# EAGLE design spsu (EAGLE 6.1)
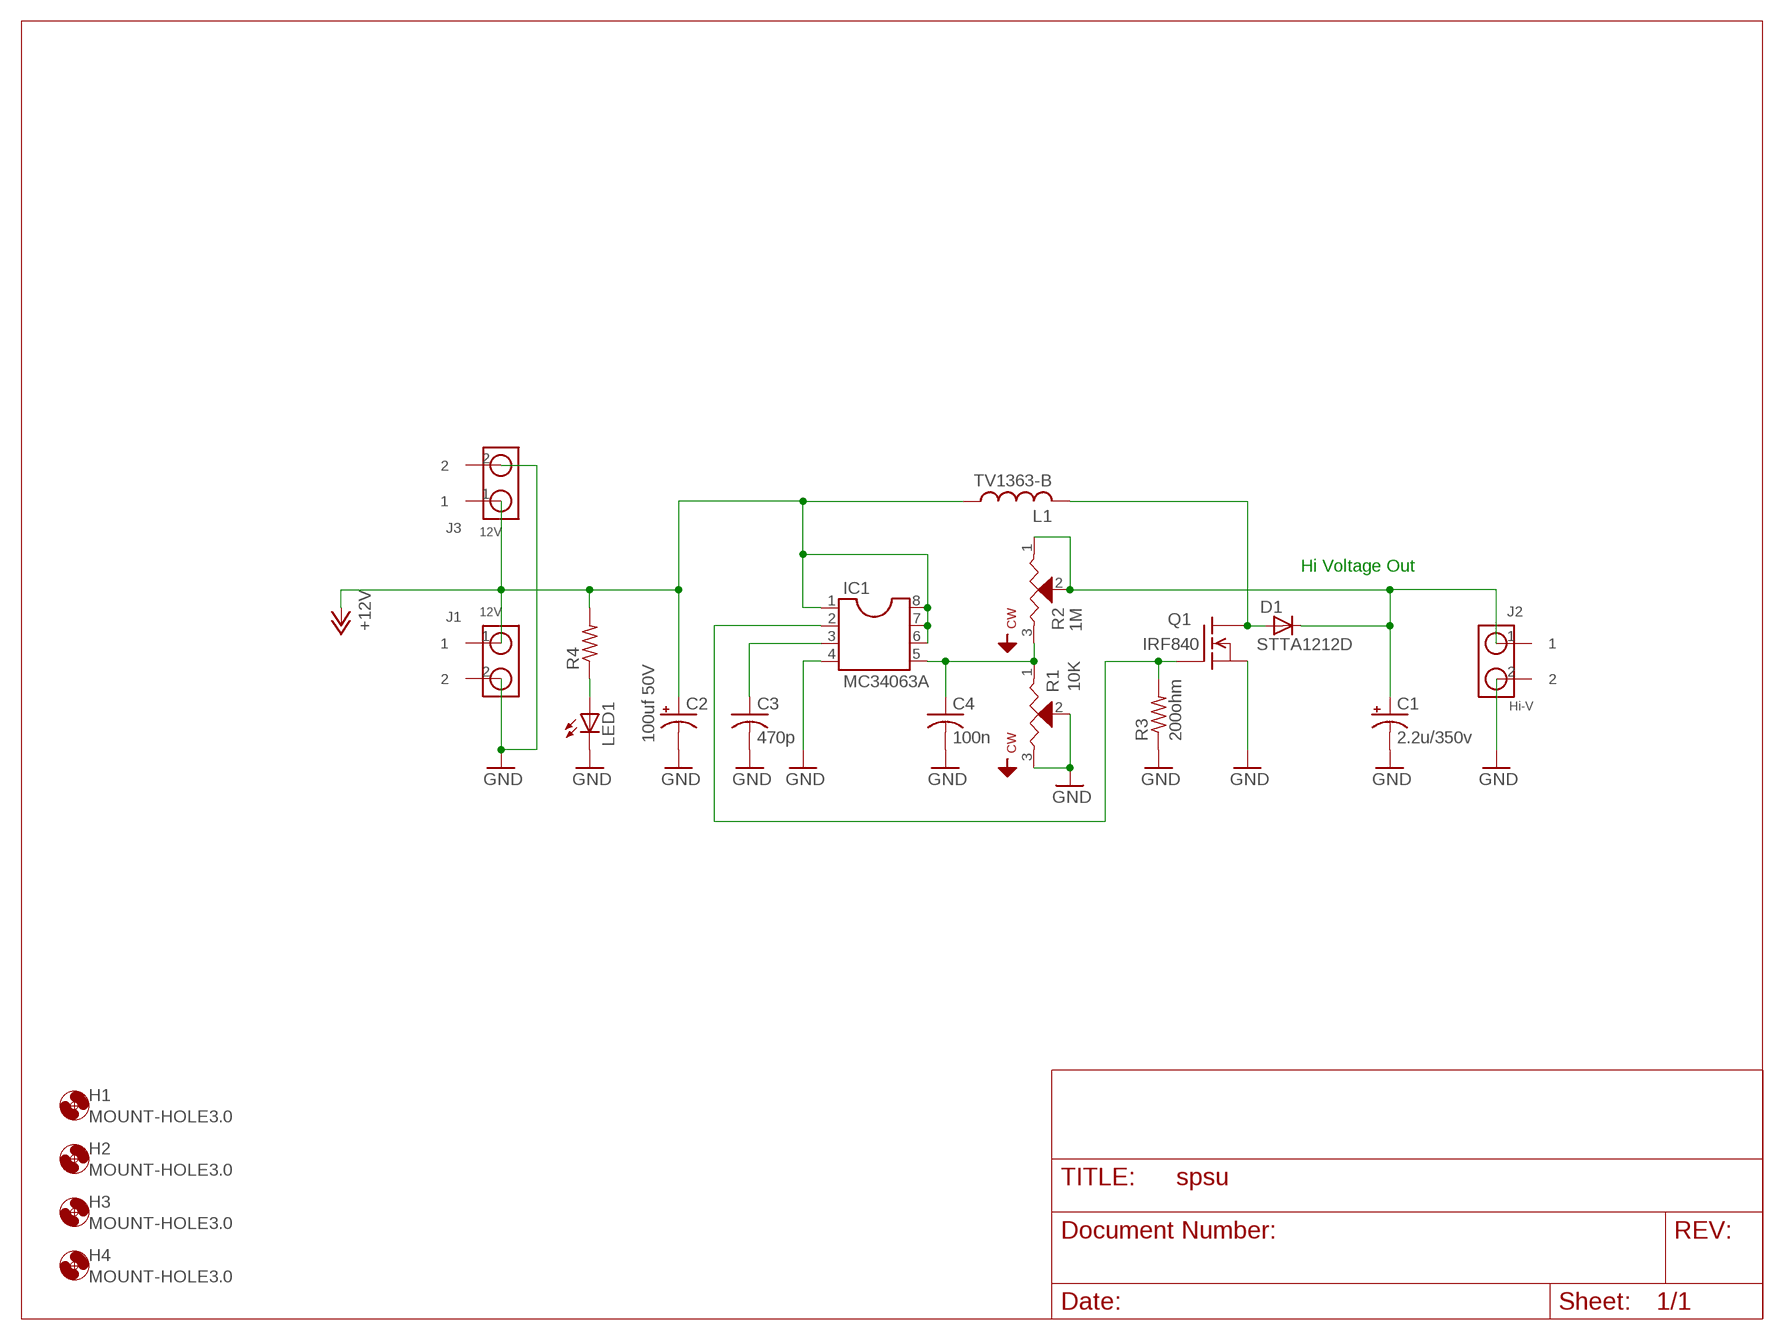
[diagram p0: schematic, sheet 1]

## Parts
C1  2.2u/350v  CPOL-USE5-8.5  [E5-8,5]
C2  100uf 50V  CPOL-USE5-8.5  [E5-8,5]
C3  470p  C-US025-040X050  [C025-040X050]
C4  100n  C-US025-040X050  [C025-040X050]
D1  STTA1212D  [TO220ACS]
H1  MOUNT-HOLE3.0  [3,0]
H2  MOUNT-HOLE3.0  [3,0]
H3  MOUNT-HOLE3.0  [3,0]
H4  MOUNT-HOLE3.0  [3,0]
IC1  MC34063A  [DIL08]
J1  12V  MOLEX-2PIN-BASE  [MOLEX-001-2PIN]
J2  Hi-V  MOLEX-2PIN-BASE  [MOLEX-001-2PIN]
J3  12V  MOLEX-2PIN-BASE  [MOLEX-001-2PIN]
L1  TV1363-B  TV1363-B-COIL  [RADIAL-VMOUNT-8-5MM]
LED1  LED3MM  [LED3MM]
Q1  IRF840  IRF840-FET  [TO220V]
R1  10K  .25SQ-TOPADJ-TRIMPOT  [.25IN-TOP-TRIMPOT]
R2  1M  .25SQ-TOPADJ-TRIMPOT  [.25IN-TOP-TRIMPOT]
R3  200ohm  R-US_0204/5  [0204/5]
R4  R-US_0204/5  [0204/5]

## Nets
+12V: C2.+ IC1.1 IC1.6 IC1.7 IC1.8 J1.1 J3.1 L1.1 R4.2
GND: C1.- C2.- C3.2 C4.2 IC1.4 J1.2 J2.2 J3.2 LED1.K(C) Q1.3(S) R1.2 R1.3 R3.1
HIVOLTAGEOUT: C1.+ D1.C J2.1 R2.1 R2.2
N$1: LED1.A R4.1
N$3: D1.A L1.2 Q1.2(D)
N$4: C4.1 IC1.5 R1.1 R2.3
N$5: C3.1 IC1.3
N$6: IC1.2 Q1.1(G) R3.2

## Notes on the sheet
- Hi Voltage Out

## Library data of the parts
C1 C2 = rcl:CPOL-US: POLARIZED CAPACITOR, American symbol
C3 C4 = rcl:C-US: CAPACITOR, American symbol
D1 = kmarx1:STTA1212D: DIODE high-efficiency fast recovery rectifier (ST) TO-220AC 12 Amp1200 Volt Mouser Part #: 511-STTA1212D 1@$1.70, 100 @ $1.45
H1-H4 = holes:MOUNT-HOLE: MOUNTING HOLE with drill center marker
IC1 = kmarx1:MC34063A: 1.5A step-up/down inverting switch regulator IC,MC34063AP1,8-DIP, SWTH V-REG STPUP/DN/INV 40VDC Jameco #: 316945 MFG:MAJOR BRANDS MFG#:MC34063AP1
J1-J3 = kmarx1:MOLEX-2PIN-BASE: Molex 2-pin header 22-03-2021,KK SERIES,FL,ST,TIN
L1 = kmarx1:TV1363-B-COIL: Coilcraft # TV1363-B. 220 uH 5% @ 100 KHz 0.1 V 0 ADC. 0.4 ohm DC resistance 0.32? dia. x 0.59? high radial choke. Leads on 5 mm centers. Tape and reel packaging Allelectronics: CAT # CR-220 4 for $ 1.00 100 for 20¢ each ? 600 for 15¢ each 1200 for 10¢ each
LED1 = led:LED: LED OSRAM: - CHIPLED LG R971, LG N971, LY N971, LG Q971, LY Q971, LO R971, LY R971 LH N974, LH R974 LS Q976, LO Q976, LY Q976 LO Q996 - Hyper CHIPLED LW Q18S LB Q993, LB Q99A, LB R99A - SideLED LS A670, LO A670, LY A670, LG A670, LP A670 LB A673, LV A673, LT A673, LW A673 LH A674 LY A675 LS A676, LA A676, LO A676, LY A676, LW A676 LS A679, LY A679, LG A679 - Hyper Micro SIDELED® LS Y876, LA Y876, LO Y876, LY Y876 LT Y87S - SmartLED LW L88C, LW L88S LB L89C, LB L89S, LG L890 LS L89K, LO L89K, LY L89K LS L896, LA L896, LO L896, LY L896 - TOPLED LS T670, LO T670, LY T670, LG T670, LP T670 LSG T670, LSP T670, LSY T670, LOP T670, LYG T670 LG T671, LOG T671, LSG T671 LB T673, LV T673, LT T673, LW T673 LH T674 LS T676, LA T676, LO T676, LY T676, LB T676, LH T676, LSB T676, LW T676 LB T67C, LV T67C, LT T67C, LS T67K, LO T67K, LY T67K, LW E67C LS E67B, LA E67B, LO E67B, LY E67B, LB E67C, LV E67C, LT E67C LW T67C LS T679, LY T679, LG T679 LS T770, LO T770, LY T770, LG T770, LP T770 LB T773, LV T773, LT T773, LW T773 LH T774 LS E675, LA E675, LY E675, LS T675 LS T776, LA T776, LO T776, LY T776, LB T776 LHGB T686 LT T68C, LB T68C - Hyper Mini TOPLED® LB M676 - Mini TOPLED Santana® LG M470 LS M47K, LO M47K, LY M47K Source: http://www.osram.convergy.de LUXEON: - LUMILED® LXK2-PW12-R00, LXK2-PW12-S00, LXK2-PW14-U00, LXK2-PW14-V00 LXK2-PM12-R00, LXK2-PM12-S00, LXK2-PM14-U00 LXK2-PE12-Q00, LXK2-PE12-R00, LXK2-PE12-S00, LXK2-PE14-T00, LXK2-PE14-U00 LXK2-PB12-K00, LXK2-PB12-L00, LXK2-PB12-M00, LXK2-PB14-N00, LXK2-PB14-P00, LXK2-PB14-Q00 LXK2-PR12-L00, LXK2-PR12-M00, LXK2-PR14-Q00, LXK2-PR14-R00 LXK2-PD12-Q00, LXK2-PD12-R00, LXK2-PD12-S00 LXK2-PH12-R00, LXK2-PH12-S00 LXK2-PL12-P00, LXK2-PL12-Q00, LXK2-PL12-R00 Source: www.luxeon.com KINGBRIGHT: KA-3528ASYC Source: www.kingbright.com
Q1 = kmarx1:IRF840-FET: N-Channel Enhancement MOSFE (HEXFET); 500V; 8A; 0,85Ohm Jameco #: 184719 1,10,100 @ $1.49,$1.29,$99 electronics goldmine; g15414 $.99/ea
R1 R2 = kmarx1:.25SQ-TOPADJ-TRIMPOT: Bourns 3262P Series Trim Pot 3262P1/4" Square Trimmer 1/2 watt cermet top adj
R3 R4 = rcl:R-US_: RESISTOR, American symbol

## Board
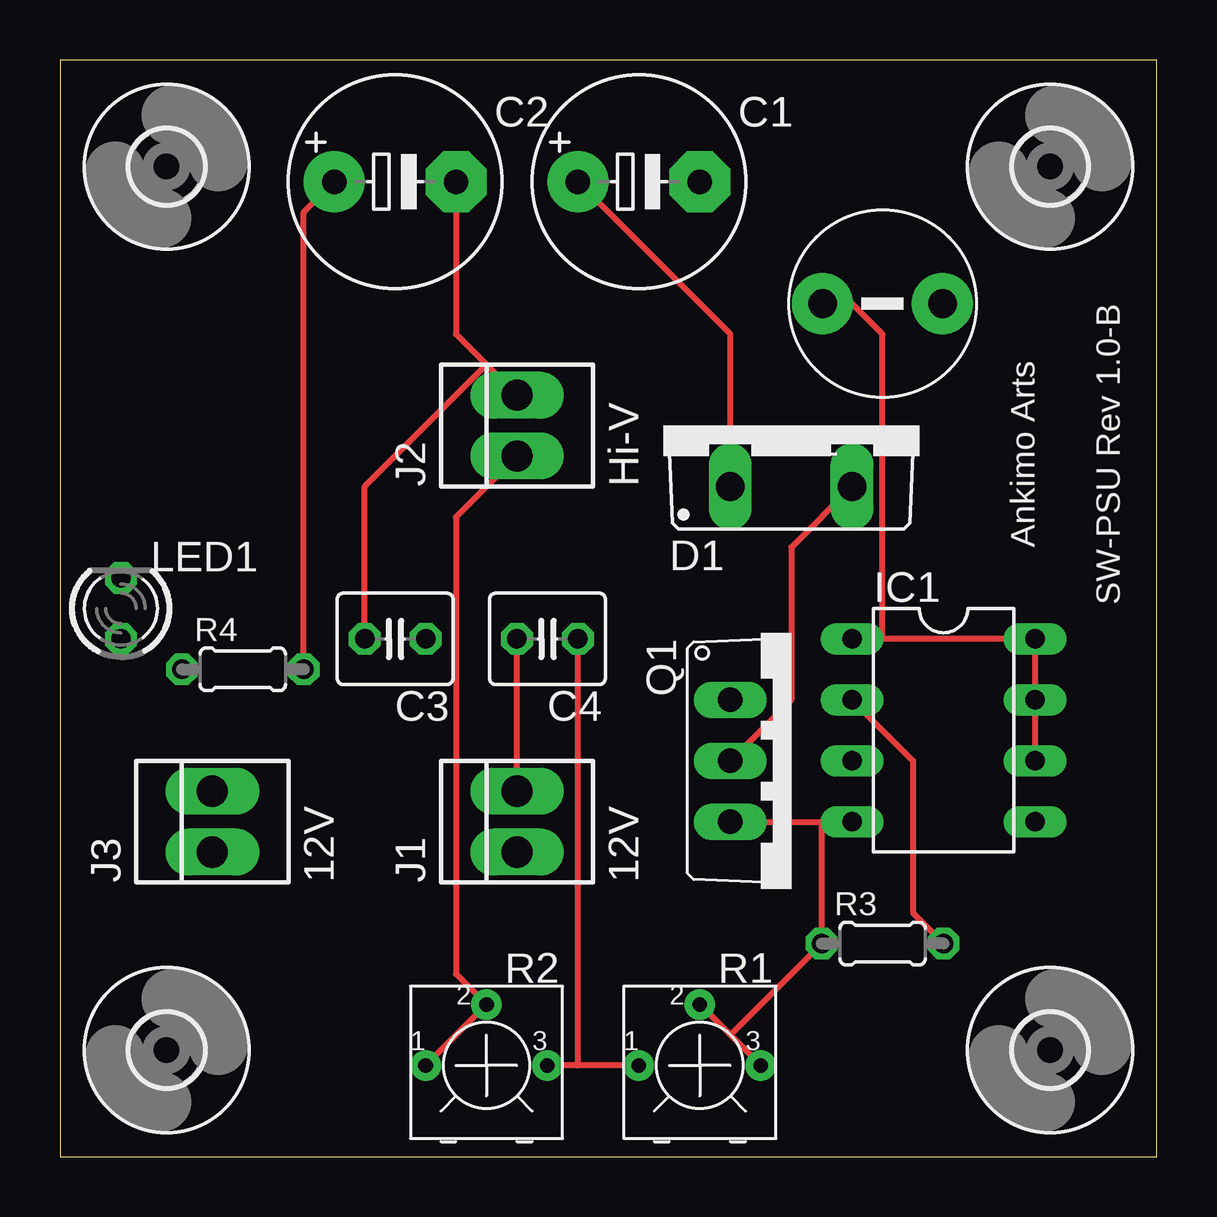
[diagram p1: board, top side]
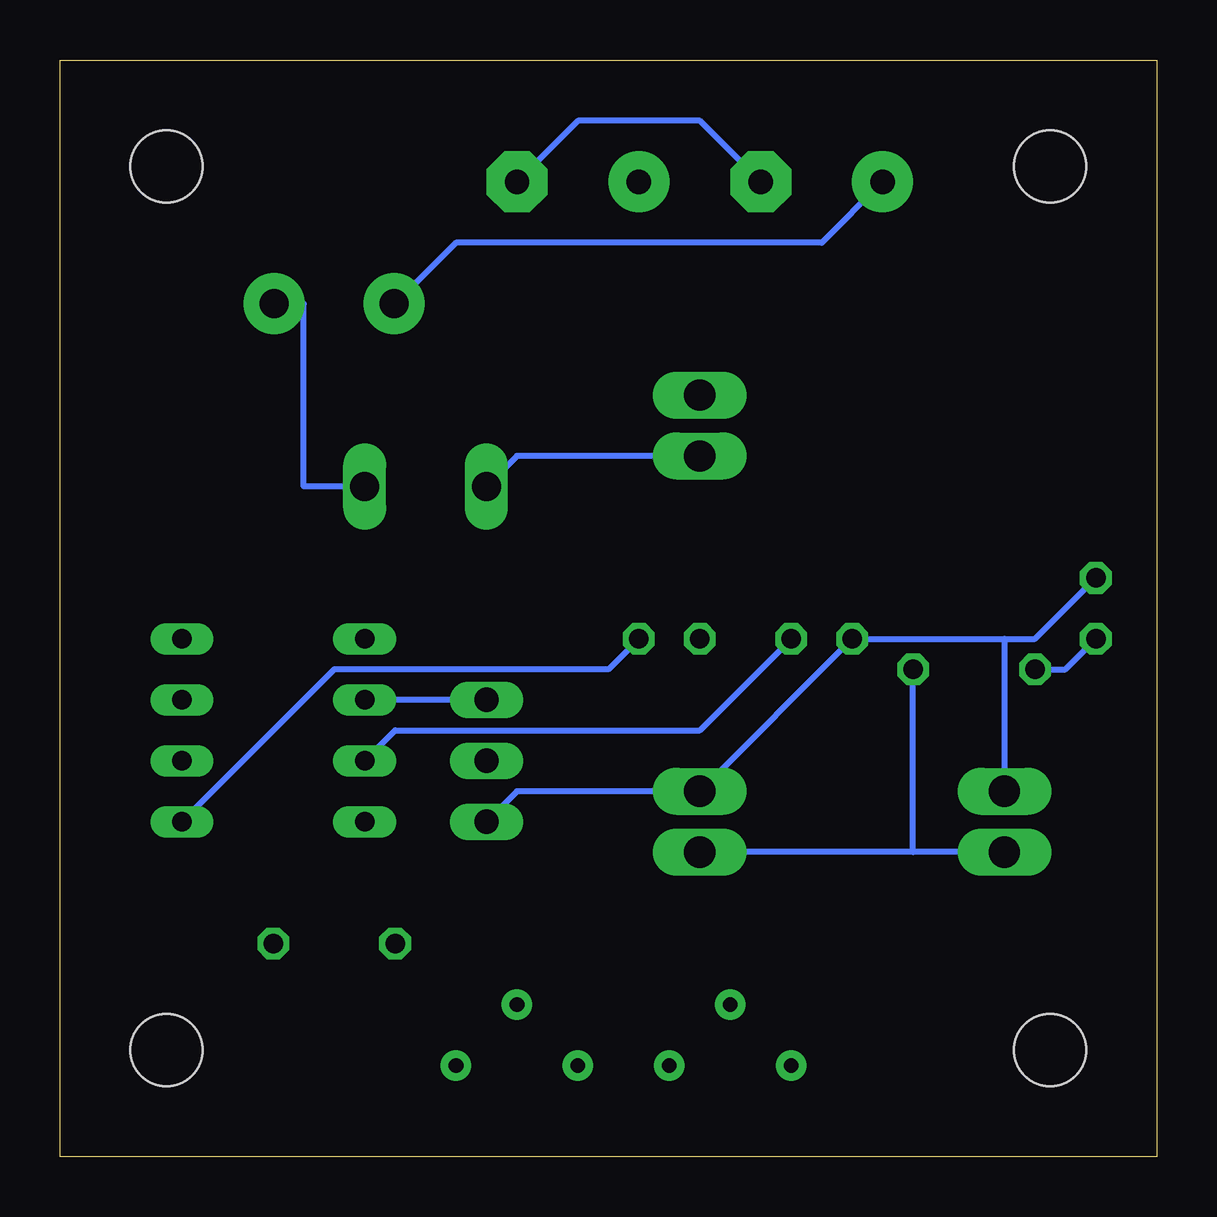
[diagram p2: board, bottom side, seen from below]

Size 45.72 x 45.72 mm. Coordinates in mm from the lower left corner, seen from the top.
Outline: 0,0 45.72,0 45.72,45.72 0,45.72 0,0
Copper layers (1*16): Top 0.035mm / dielectric 1.5mm / Bottom 0.035mm
Design rules: minimum track width 10mil, minimum drill 24mil, track to track 8mil, track to pad 8mil, pad to pad 8mil, via to via 8mil, smd to smd 8mil, copper to edge 40mil, drill to drill 8mil, minimum pad ring 10mil, minimum via ring 8mil, stop-mask expansion 4mil, vias tented up to drill 0mil, thermal gap 10mil

### Footprints (pad centres in the part's own frame; a part is rotated, then mirrored left to right if it is on the bottom)
E5-8,5 = drill 1.016 pad 2.54: + -2.54,0 | drill 1.016 pad 2.54 octagon: - 2.54,0
C025-040X050 = drill 0.813 octagon: 1 -1.27,0; 2 1.27,0
TO220ACS = drill 1.2 long: A 2.54,0 | drill 1.2 pad 1.778 long: C -2.54,0
3,0 = hole 3: 0,0
DIL08 = drill 0.813 long: 1 -3.81,-3.81; 2 -1.27,-3.81; 3 1.27,-3.81; 4 3.81,-3.81; 5 3.81,3.81; 6 1.27,3.81; 7 -1.27,3.81; 8 -3.81,3.81
MOLEX-001-2PIN = drill 1.3 long: 1 -1.27,0; 2 1.27,0
RADIAL-VMOUNT-8-5MM = drill 1.2 pad 2.54: 1 -2.5,0; 2 2.5,0
LED3MM = drill 0.813 octagon: A -1.27,0; K 1.27,0
TO220V = drill 1.016 long: 1 -2.54,0; 2 0,0; 3 2.54,0
.25IN-TOP-TRIMPOT = drill 0.61 pad 1.27: 1 -2.54,0; 2 0,2.54; 3 2.54,0
0204/5 = drill 0.813 octagon: 1 -2.54,0; 2 2.54,0

### Placement (x,y rotation side)
C1  24.13,40.64 0 top
C2  13.97,40.64 0 top
C3  13.97,21.59 180 top
C4  20.32,21.59 180 top
D1  30.48,27.94 0 top
H1  4.45,41.27 0 top
H2  4.45,4.45 0 top
H3  41.27,41.27 0 top
H4  41.27,4.45 0 top
IC1  36.83,17.78 270 top
J1  19.05,13.97 90 top
J2  19.05,30.48 90 top
J3  6.35,13.97 90 top
L1  34.29,35.56 0 top
LED1  2.54,22.86 90 top
Q1  27.94,16.51 270 top
R1  26.67,3.81 0 top
R2  17.78,3.81 0 top
R3  34.29,8.89 0 top
R4  7.62,20.32 0 top

### Tracks (layer width: path | path; a pad name or v marks a point on that pad's centre or on a via)
+12V
  Top 0.254: IC1.6 IC1.7 IC1.8 34.29,21.59 | 34.29,21.59 34.29,34.29 33.02,35.56 L1.1 | 34.29,21.59 IC1.1 | C2.+ 10.16,39.37 R4.2
  Bottom 0.254: 10.16,12.7 R4.2 | J3.1 10.16,12.7 | 10.16,12.7 J1.1 | C2.+ 13.97,38.1 29.21,38.1 31.75,35.56 L1.1
GND
  Top 0.254: 17.78,33.02 16.51,34.29 C2.- | 17.78,33.02 J2.2 | Q1.3 31.75,13.97 | R1.3 27.94,5.08 | 27.94,5.08 R1.2 | 27.94,5.08 R3.1 31.75,13.97 | 31.75,13.97 IC1.4 | J1.2 C4.2 | 17.78,33.02 12.7,27.94 C3.2
  Bottom 0.254: C1.- 24.13,43.18 19.05,43.18 C2.- | LED1.K 5.08,21.59 6.35,21.59 | 6.35,21.59 C3.2 J1.2 26.67,15.24 Q1.3 | 6.35,21.59 J3.2
HIVOLTAGEOUT
  Top 0.254: R2.1 R2.2 16.51,7.62 16.51,26.67 J2.1 | C1.+ 27.94,34.29 D1.C
  Bottom 0.254: D1.C 26.67,29.21 J2.1
N$1
  Bottom 0.254: LED1.A 3.81,20.32 R4.1
N$3
  Top 0.254: Q1.2 30.48,19.05 30.48,25.4 D1.A
  Bottom 0.254: D1.A 35.56,27.94 35.56,35.56 L1.2
N$4
  Top 0.254: R1.1 21.59,3.81 | 21.59,3.81 R2.3 | 21.59,3.81 C4.1
  Bottom 0.254: IC1.5 34.29,20.32 22.86,20.32 C4.1
N$5
  Bottom 0.254: C3.1 19.05,17.78 31.75,17.78 IC1.3
N$6
  Top 0.254: R3.2 35.56,10.16 35.56,16.51 IC1.2
  Bottom 0.254: Q1.1 IC1.2

### Text on the board
tPlace: SW-PSU Rev 1.0-B | Ankimo Arts